# Altium project M_G_T.PrjPcb
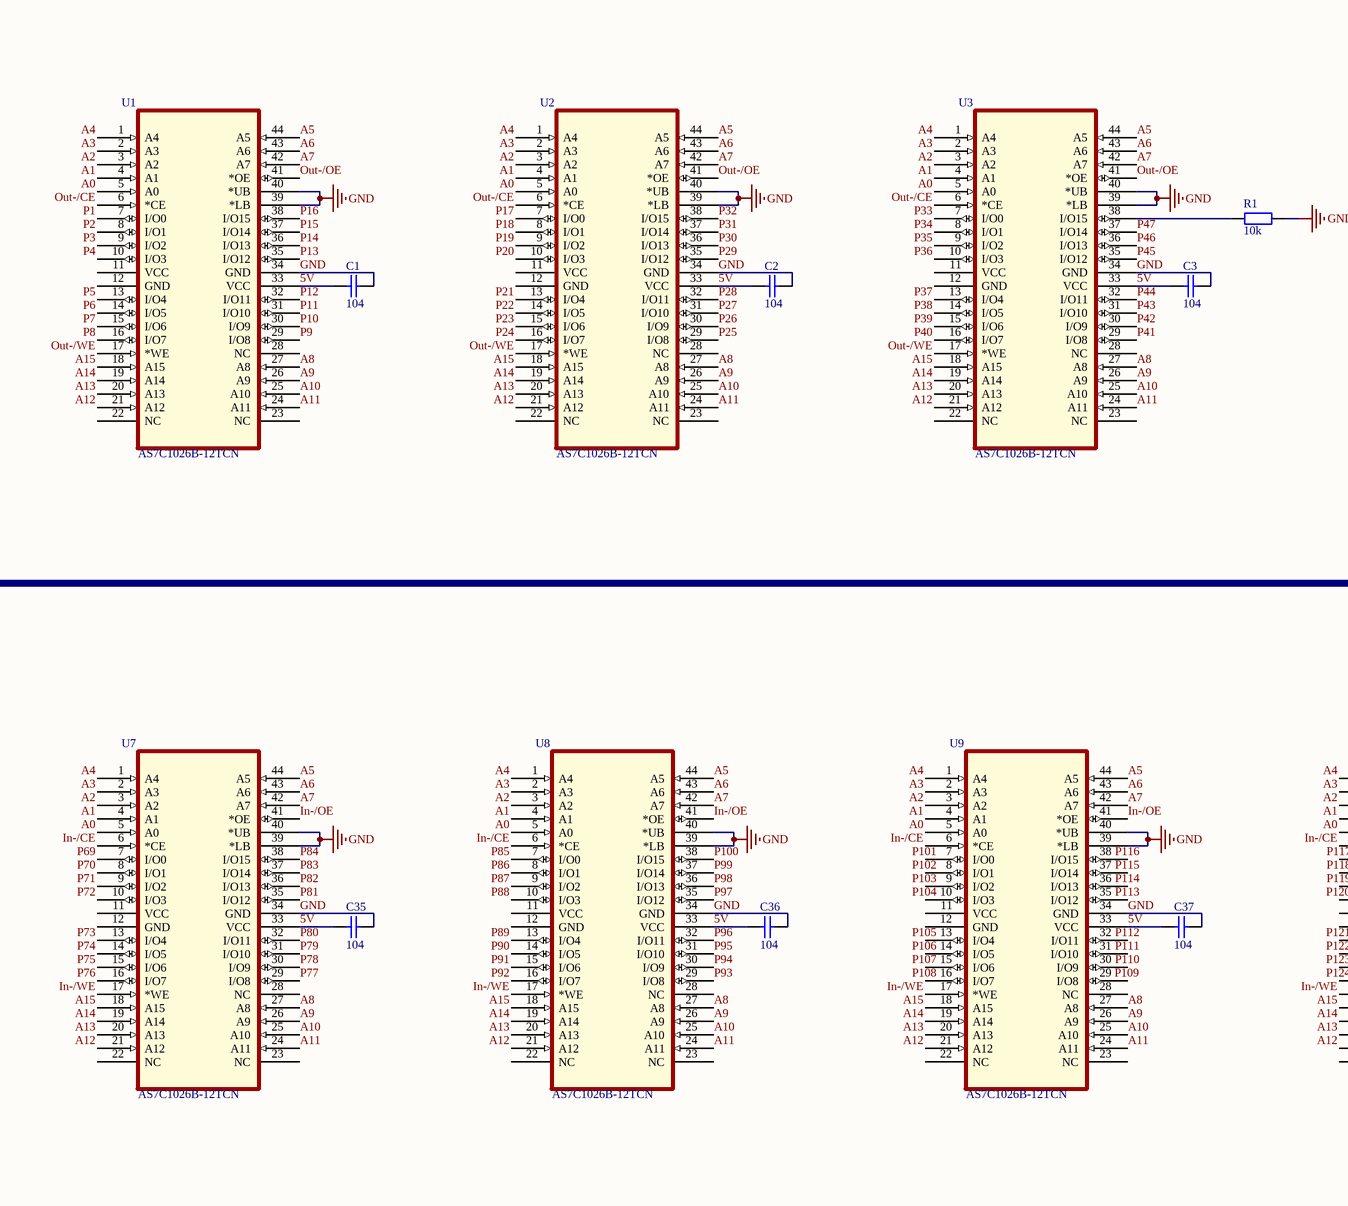
[diagram p0: M_G_T.SchDoc, top left]
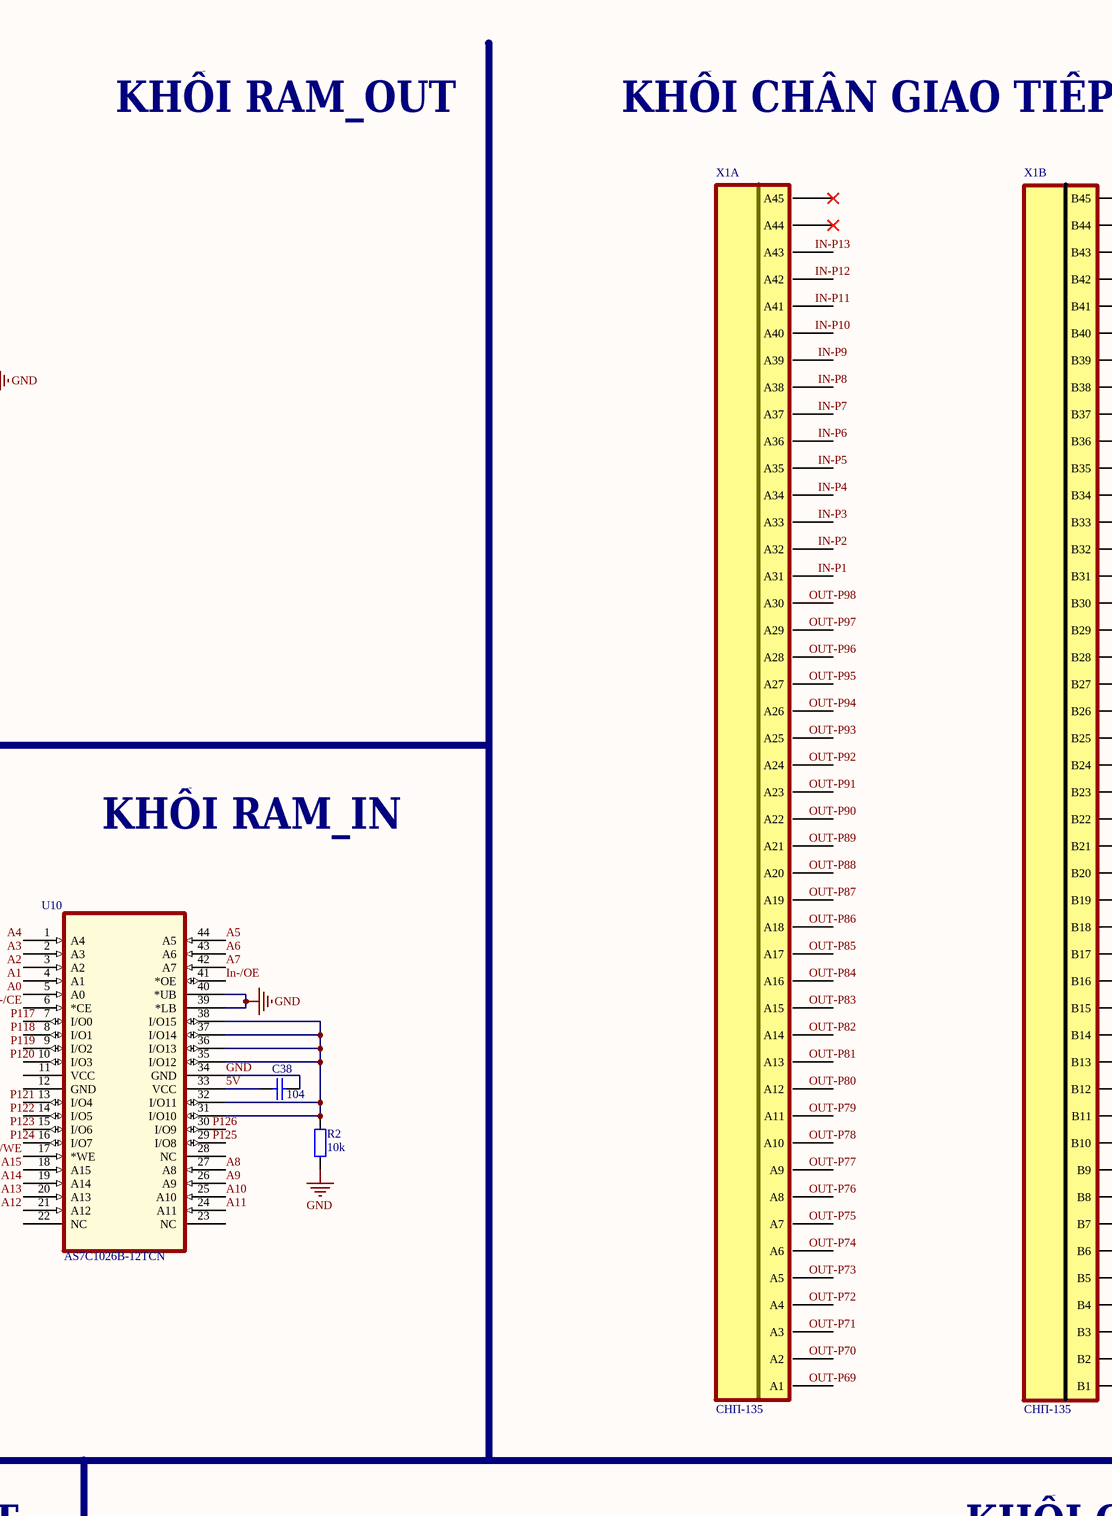
[diagram p1: M_G_T.SchDoc, top middle]
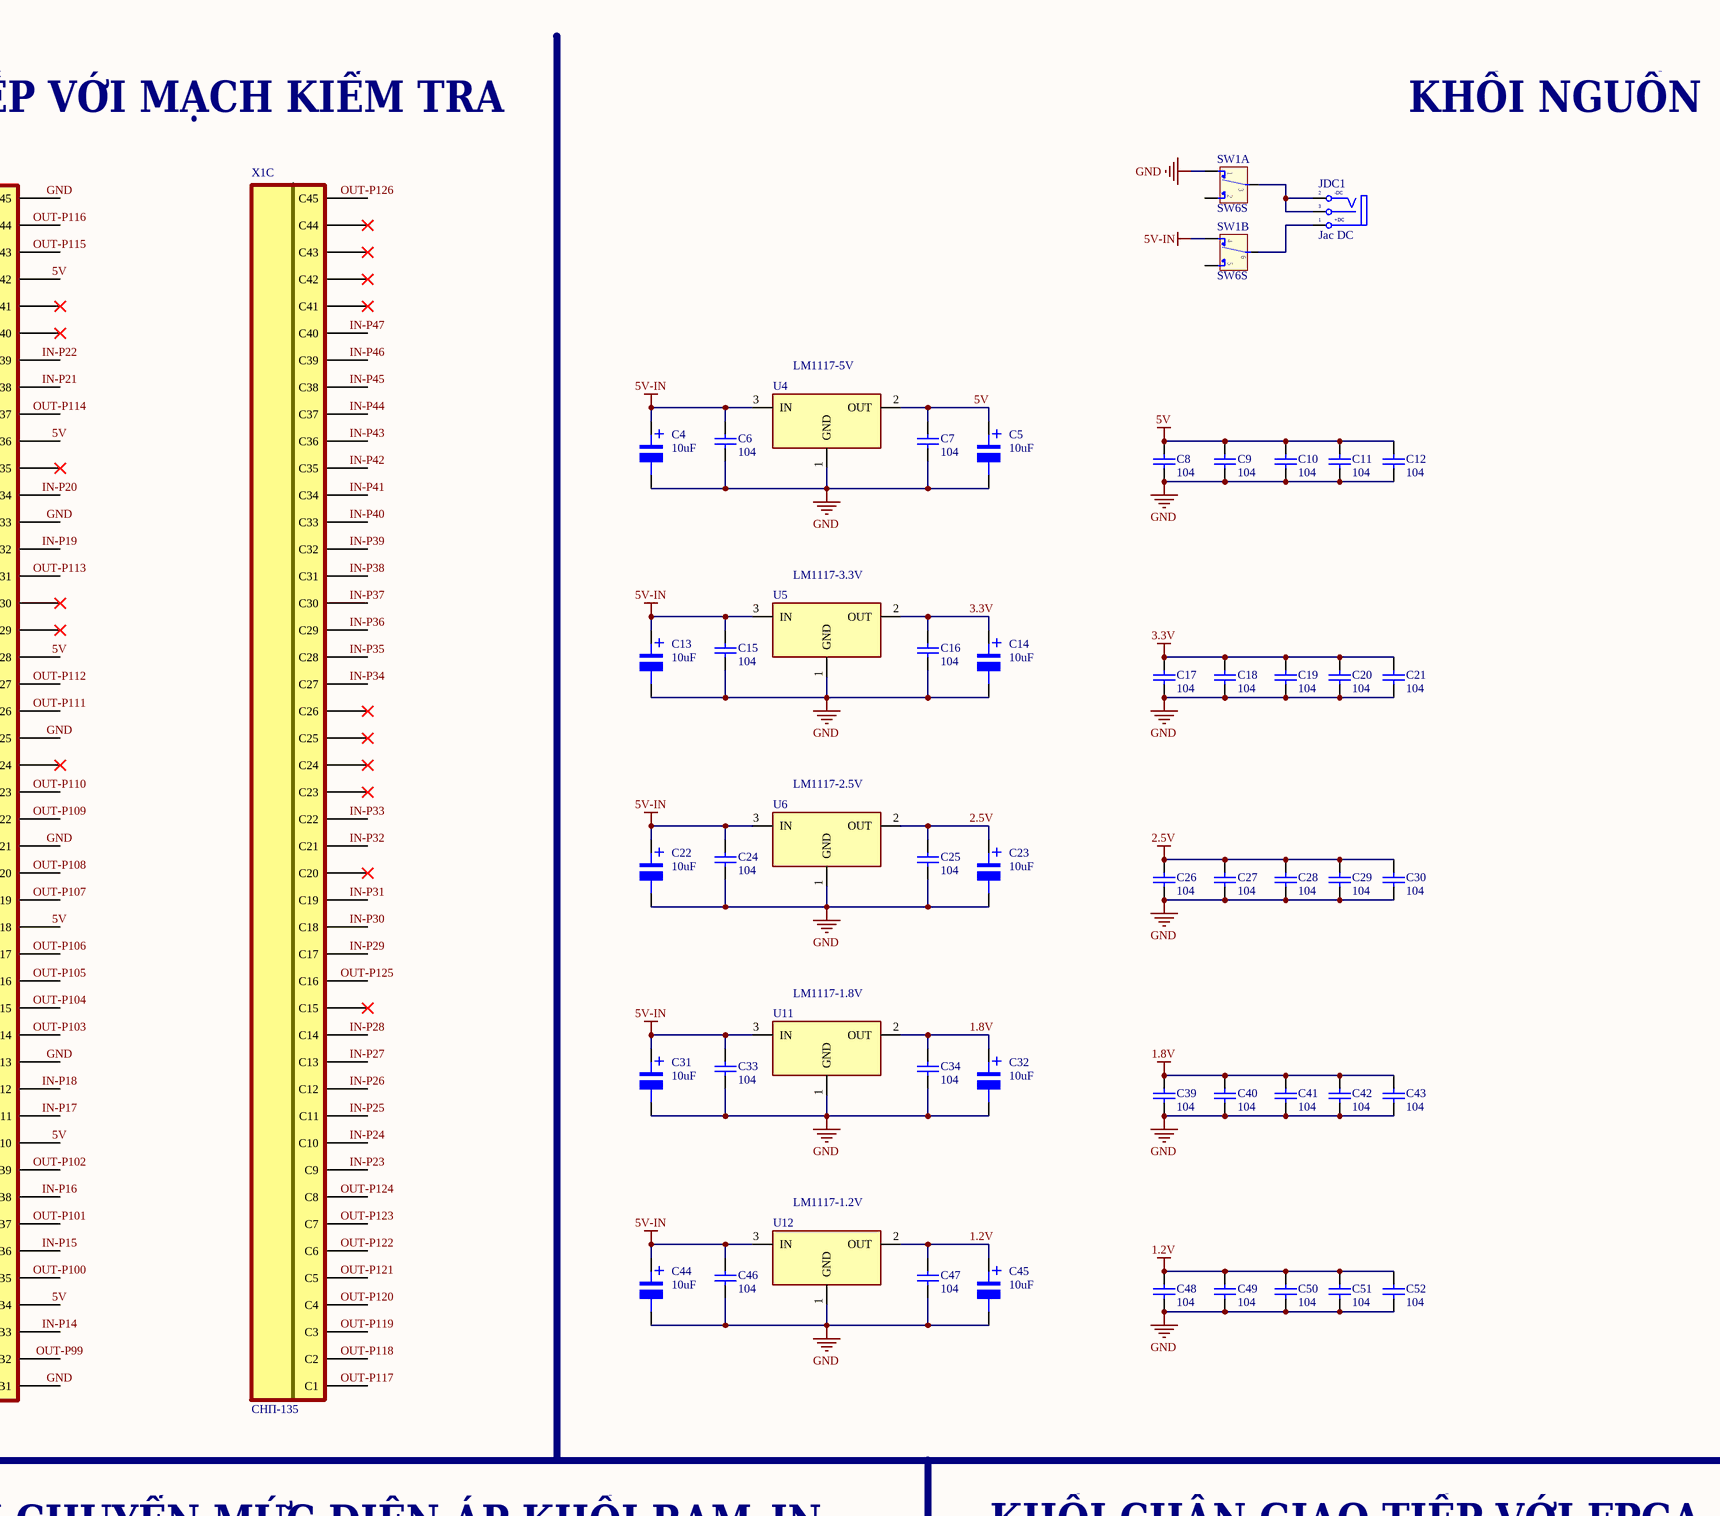
[diagram p2: M_G_T.SchDoc, top right]
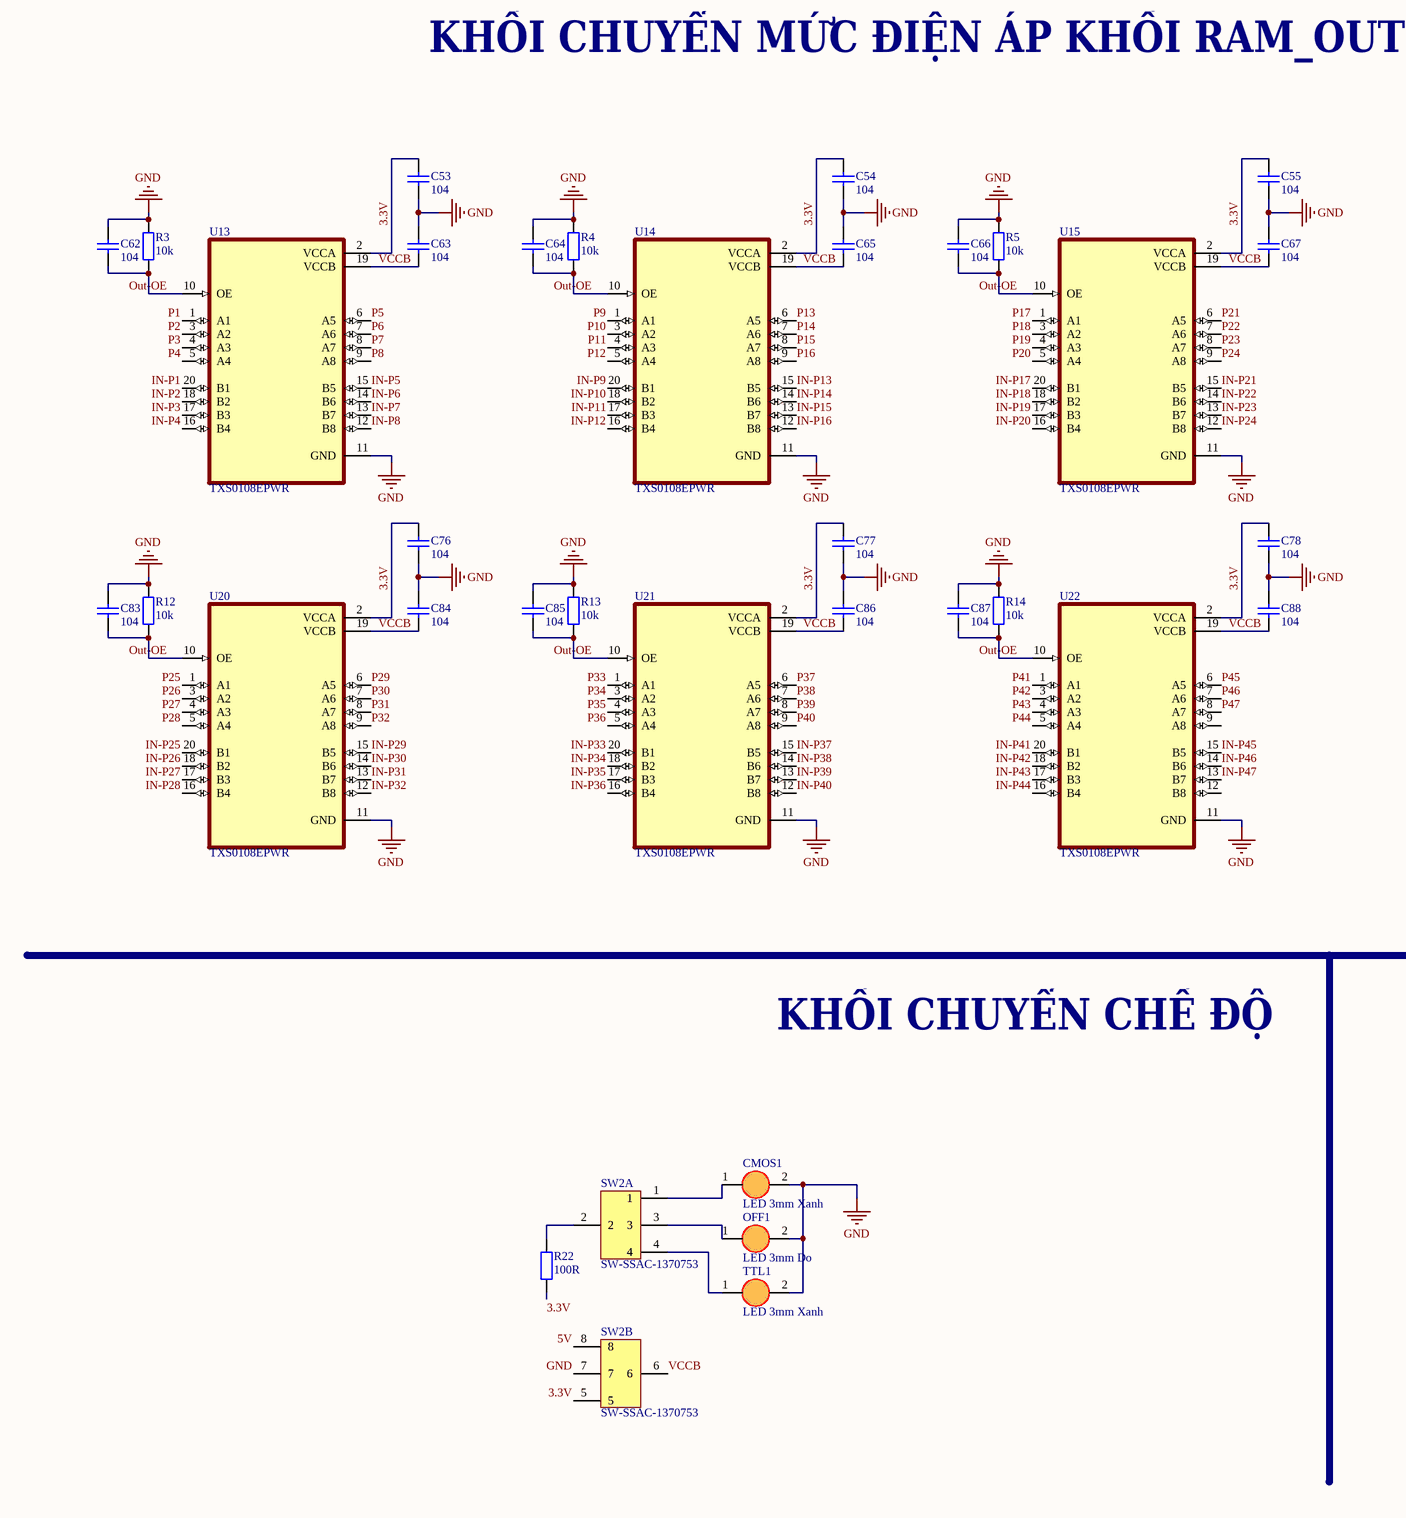
[diagram p3: M_G_T.SchDoc, bottom left]
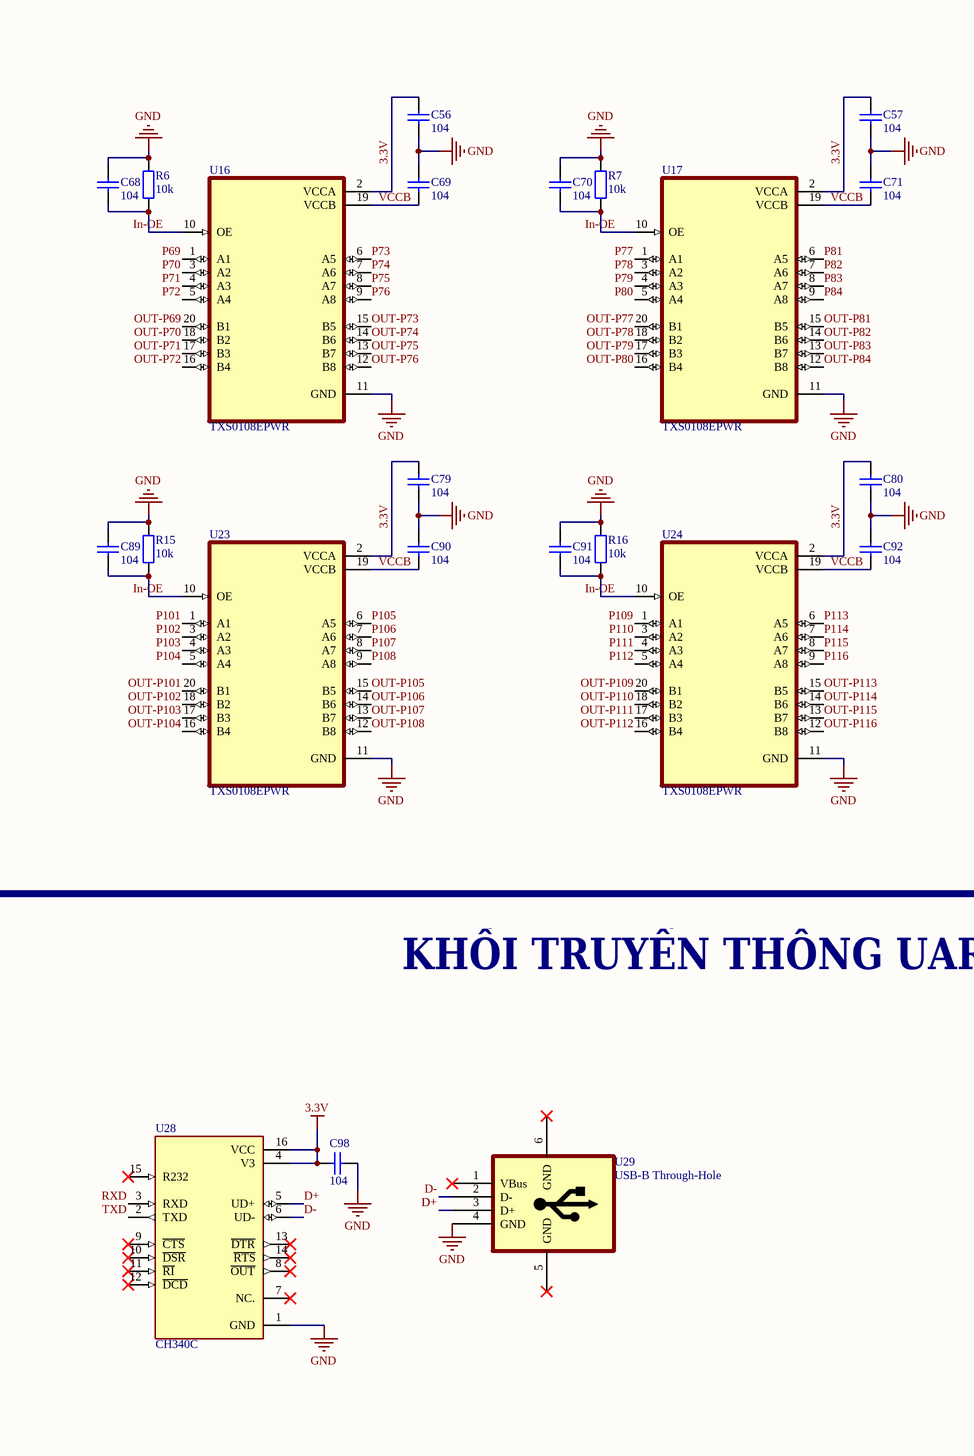
[diagram p4: M_G_T.SchDoc, bottom middle]
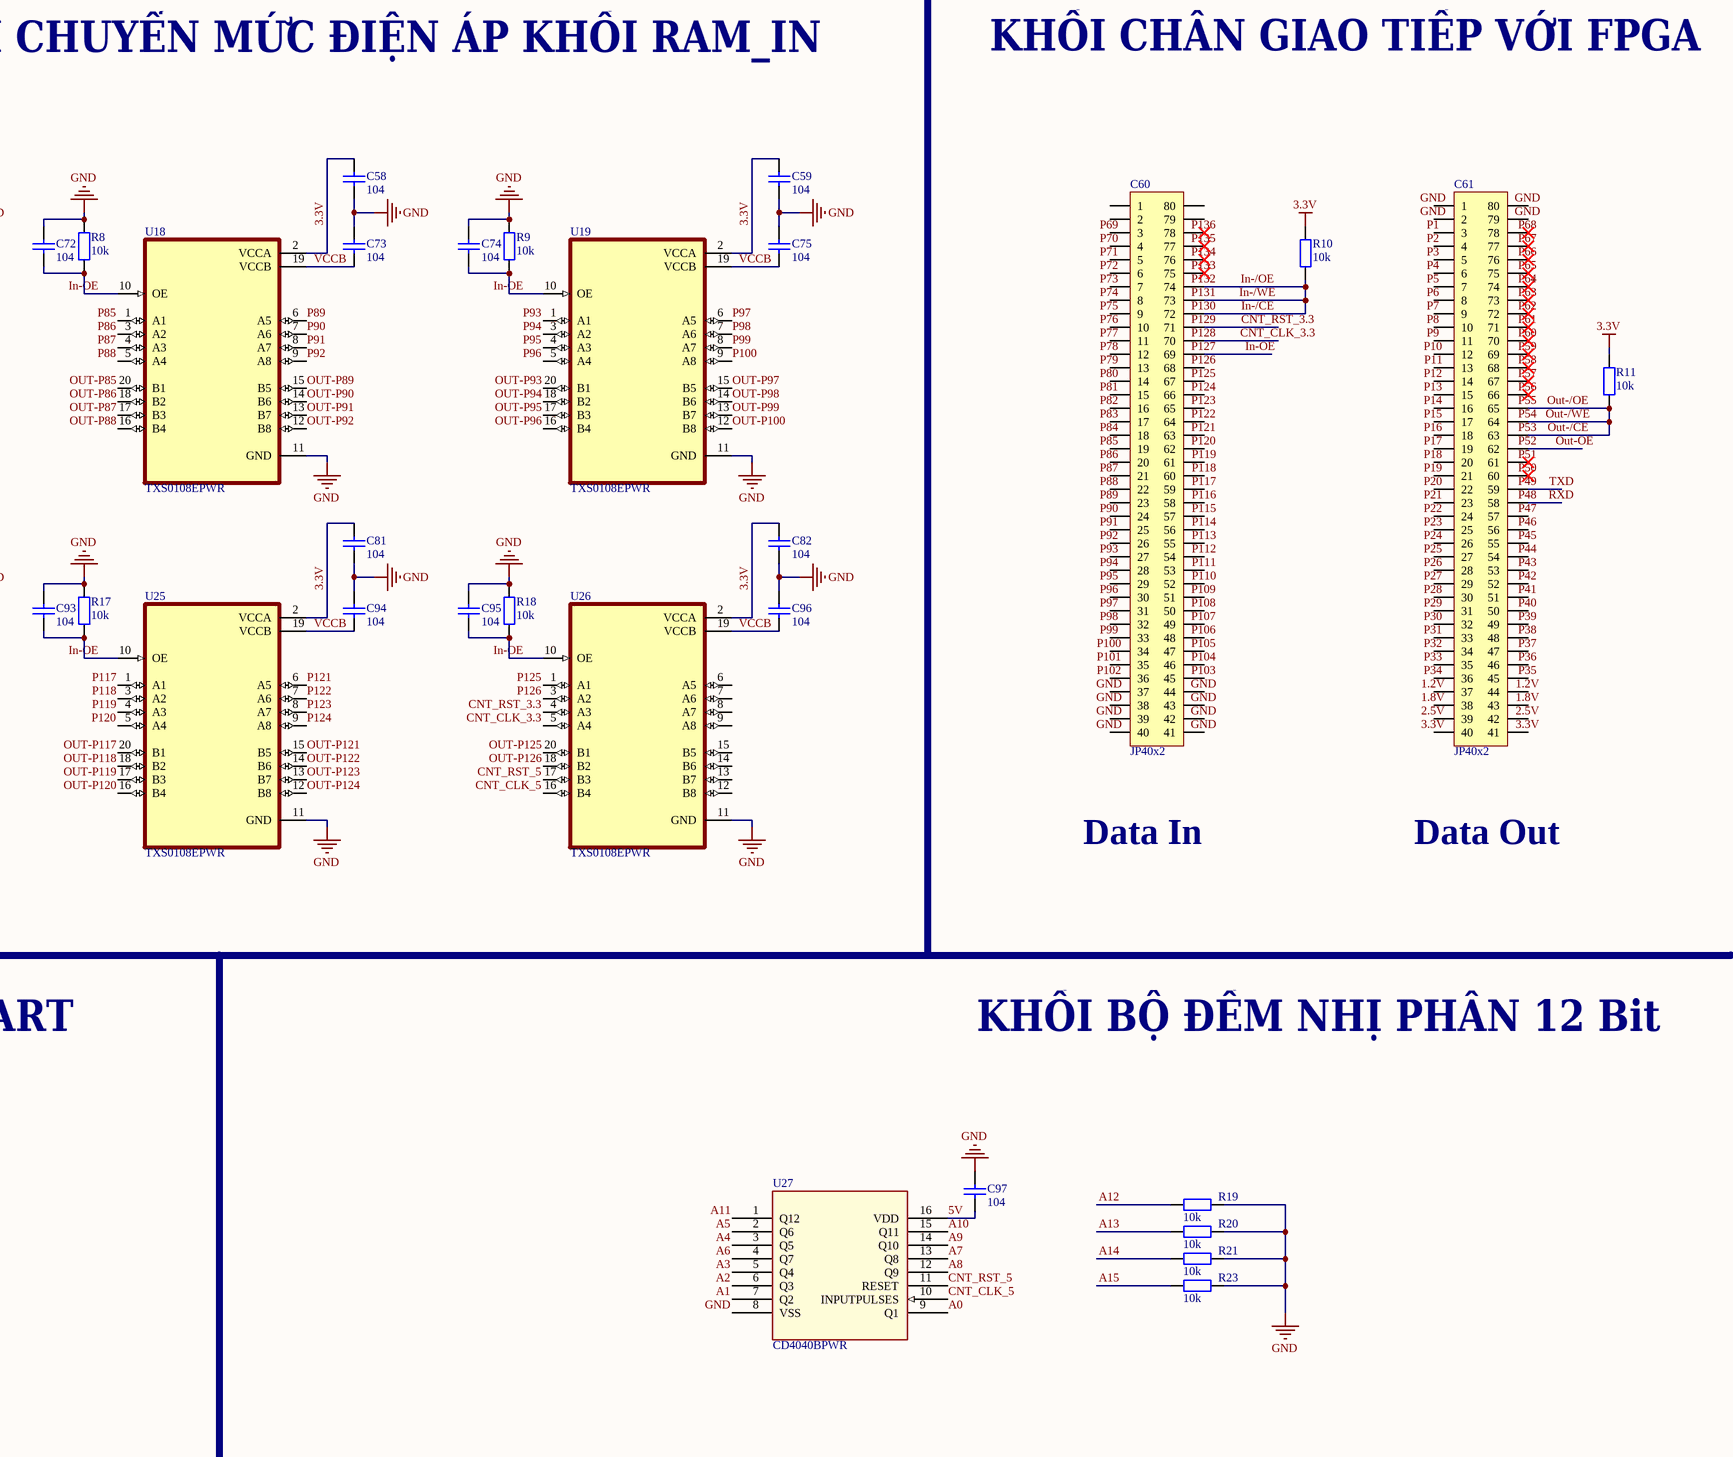
[diagram p5: M_G_T.SchDoc, bottom right]
1 sheet, 157 parts. Net scope: global (net labels, ports and power ports of the same name join across sheets).
Board file: M_G_T.PcbDoc

## Sheet M_G_T.SchDoc
size A1

### Parts
C1  104  [Tu 0805]
C2  104  [Tu 0805]
C3  104  [Tu 0805]
C4  10uF  [tu nhom 4 (b)]
C5  10uF  [tu nhom 4 (b)]
C6  104  [Tu 0805]
C7  104  [Tu 0805]
C8  104  [Tu 0805]
C9  104  [Tu 0805]
C10  104  [Tu 0805]
C11  104  [Tu 0805]
C12  104  [Tu 0805]
C13  10uF  [tu nhom 4 (b)]
C14  10uF  [tu nhom 4 (b)]
C15  104  [Tu 0805]
C16  104  [Tu 0805]
C17  104  [Tu 0805]
C18  104  [Tu 0805]
C19  104  [Tu 0805]
C20  104  [Tu 0805]
C21  104  [Tu 0805]
C22  10uF  [tu nhom 4 (b)]
C23  10uF  [tu nhom 4 (b)]
C24  104  [Tu 0805]
C25  104  [Tu 0805]
C26  104  [Tu 0805]
C27  104  [Tu 0805]
C28  104  [Tu 0805]
C29  104  [Tu 0805]
C30  104  [Tu 0805]
C31  10uF  [tu nhom 4 (b)]
C32  10uF  [tu nhom 4 (b)]
C33  104  [Tu 0805]
C34  104  [Tu 0805]
C35  104  [Tu 0805]
C36  104  [Tu 0805]
C37  104  [Tu 0805]
C38  104  [Tu 0805]
C39  104  [Tu 0805]
C40  104  [Tu 0805]
C41  104  [Tu 0805]
C42  104  [Tu 0805]
C43  104  [Tu 0805]
C44  10uF  [tu nhom 4 (b)]
C45  10uF  [tu nhom 4 (b)]
C46  104  [Tu 0805]
C47  104  [Tu 0805]
C48  104  [Tu 0805]
C49  104  [Tu 0805]
C50  104  [Tu 0805]
C51  104  [Tu 0805]
C52  104  [Tu 0805]
C53  104  [Tu 0805]
C54  104  [Tu 0805]
C55  104  [Tu 0805]
C56  104  [Tu 0805]
C57  104  [Tu 0805]
C58  104  [Tu 0805]
C59  104  [Tu 0805]
C60  JP40x2  [JP40-D2T]
C61  JP40x2  [JP40-D2T]
C62  104  [Tu 0805]
C63  104  [Tu 0805]
C64  104  [Tu 0805]
C65  104  [Tu 0805]
C66  104  [Tu 0805]
C67  104  [Tu 0805]
C68  104  [Tu 0805]
C69  104  [Tu 0805]
C70  104  [Tu 0805]
C71  104  [Tu 0805]
C72  104  [Tu 0805]
C73  104  [Tu 0805]
C74  104  [Tu 0805]
C75  104  [Tu 0805]
C76  104  [Tu 0805]
C77  104  [Tu 0805]
C78  104  [Tu 0805]
C79  104  [Tu 0805]
C80  104  [Tu 0805]
C81  104  [Tu 0805]
C82  104  [Tu 0805]
C83  104  [Tu 0805]
C84  104  [Tu 0805]
C85  104  [Tu 0805]
C86  104  [Tu 0805]
C87  104  [Tu 0805]
C88  104  [Tu 0805]
C89  104  [Tu 0805]
C90  104  [Tu 0805]
C91  104  [Tu 0805]
C92  104  [Tu 0805]
C93  104  [Tu 0805]
C94  104  [Tu 0805]
C95  104  [Tu 0805]
C96  104  [Tu 0805]
C97  104  [Tu 0805]
C98  104  [Tu 0805]
CMOS1  LED 3mm Xanh  [LED 3MM XANH]
JDC1  Jac DC  [DC-IN]
OFF1  LED 3mm Do  [LED 3mm Do]
R1  10k  [tro smd 0805]
R2  10k  [tro smd 0805]
R3  10k  [tro smd 0805]
R4  10k  [tro smd 0805]
R5  10k  [tro smd 0805]
R6  10k  [tro smd 0805]
R7  10k  [tro smd 0805]
R8  10k  [tro smd 0805]
R9  10k  [tro smd 0805]
R10  10k  [tro smd 0805]
R11  10k  [tro smd 0805]
R12  10k  [tro smd 0805]
R13  10k  [tro smd 0805]
R14  10k  [tro smd 0805]
R15  10k  [tro smd 0805]
R16  10k  [tro smd 0805]
R17  10k  [tro smd 0805]
R18  10k  [tro smd 0805]
R19  10k  [tro smd 0805]
R20  10k  [tro smd 0805]
R21  10k  [tro smd 0805]
R22  100R  [tro smd 0805]
R23  10k  [tro smd 0805]
SW1  SW6S  [SW6]  (parts A,B of 2)
SW2  SW-SSAC-1370753  [SW-SSAC-1370753]  (parts A,B of 2)
TTL1  LED 3mm Xanh  [LED 3MM XANH]
U1  AS7C1026B-12TCN  [TSOP-44_MIL400_ALL-M]
U2  AS7C1026B-12TCN  [TSOP-44_MIL400_ALL-M]
U3  AS7C1026B-12TCN  [TSOP-44_MIL400_ALL-M]
U4  LM1117-5V  [LM1117-SOP]
U5  LM1117-3.3V  [LM1117-SOP]
U6  LM1117-2.5V  [LM1117-SOP]
U7  AS7C1026B-12TCN  [TSOP-44_MIL400_ALL-M]
U8  AS7C1026B-12TCN  [TSOP-44_MIL400_ALL-M]
U9  AS7C1026B-12TCN  [TSOP-44_MIL400_ALL-M]
U10  AS7C1026B-12TCN  [TSOP-44_MIL400_ALL-M]
U11  LM1117-1.8V  [LM1117-SOP]
U12  LM1117-1.2V  [LM1117-SOP]
U13  TXS0108EPWR  [SOP65P640X120-20N]
U14  TXS0108EPWR  [SOP65P640X120-20N]
U15  TXS0108EPWR  [SOP65P640X120-20N]
U16  TXS0108EPWR  [SOP65P640X120-20N]
U17  TXS0108EPWR  [SOP65P640X120-20N]
U18  TXS0108EPWR  [SOP65P640X120-20N]
U19  TXS0108EPWR  [SOP65P640X120-20N]
U20  TXS0108EPWR  [SOP65P640X120-20N]
U21  TXS0108EPWR  [SOP65P640X120-20N]
U22  TXS0108EPWR  [SOP65P640X120-20N]
U23  TXS0108EPWR  [SOP65P640X120-20N]
U24  TXS0108EPWR  [SOP65P640X120-20N]
U25  TXS0108EPWR  [SOP65P640X120-20N]
U26  TXS0108EPWR  [SOP65P640X120-20N]
U27  CD4040BPWR  [PW16-M]
U28  CH340C  [SOIC127P600X180-16N]
U29  USB-B Through-Hole  [USB2.5-2H4D]
X1  СНП-135  [X2N]  (parts A,B,C of 3)

### Nets
1.2V: C45.1 C47.2 C48.2 C49.2 C50.2 C51.2 C52.2 C61.37 C61.44 U12.2(OUT)
1.8V: C32.1 C34.2 C39.2 C40.2 C41.2 C42.2 C43.2 C61.38 C61.43 U11.2(OUT)
2.5V: C23.1 C25.2 C26.2 C27.2 C28.2 C29.2 C30.2 C61.39 C61.42 U6.2(OUT)
3.3V: C14.1 C16.2 C17.2 C18.2 C19.2 C20.2 C21.2 C53.1 C54.1 C55.1 C56.1 C57.1 C58.1 C59.1 C61.40 C61.41 C76.1 C77.1 C78.1 C79.1 C80.1 C81.1 C82.1 C98.1 R10.1 R11.1 R22.1 SW2.5 U5.2(OUT) U13.2(VCCA) U14.2(VCCA) U15.2(VCCA) U16.2(VCCA) U17.2(VCCA) U18.2(VCCA) U19.2(VCCA) U20.2(VCCA) U21.2(VCCA) U22.2(VCCA) U23.2(VCCA) U24.2(VCCA) U25.2(VCCA) U26.2(VCCA) U28.4(V3) U28.16(VCC)
5V: C1.2 C2.2 C3.2 C5.1 C7.2 C8.2 C9.2 C10.2 C11.2 C12.2 C35.2 C36.2 C37.2 C38.2 C97.2 SW2.8 U1.33(VCC) U2.33(VCC) U3.33(VCC) U4.2(OUT) U7.33(VCC) U8.33(VCC) U9.33(VCC) U10.33(VCC) U27.16(VDD) X1.49(B4) X1.55(B10) X1.63(B18) X1.73(B28) X1.81(B36) X1.87(B42)
5V-IN: C4.1 C6.2 C13.1 C15.2 C22.1 C24.2 C31.1 C33.2 C44.1 C46.2 SW1.4 U4.3(IN) U5.3(IN) U6.3(IN) U11.3(IN) U12.3(IN)
GND: C1.1 C2.1 C3.1 C4.2 C5.2 C6.1 C7.1 C8.1 C9.1 C10.1 C11.1 C12.1 C13.2 C14.2 C15.1 C16.1 C17.1 C18.1 C19.1 C20.1 C21.1 C22.2 C23.2 C24.1 C25.1 C26.1 C27.1 C28.1 C29.1 C30.1 C31.2 C32.2 C33.1 C34.1 C35.1 C36.1 C37.1 C38.1 C39.1 C40.1 C41.1 C42.1 C43.1 C44.2 C45.2 C46.1 C47.1 C48.1 C49.1 C50.1 C51.1 C52.1 C53.2 C54.2 C55.2 C56.2 C57.2 C58.2 C59.2 C60.37 C60.38 C60.39 C60.40 C60.41 C60.42 C60.43 C60.44 C61.1 C61.2 C61.79 C61.80 C62.1 C63.1 C64.1 C65.1 C66.1 C67.1 C68.1 C69.1 C70.1 C71.1 C72.1 C73.1 C74.1 C75.1 C76.2 C77.2 C78.2 C79.2 C80.2 C81.2 C82.2 C83.1 C84.1 C85.1 C86.1 C87.1 C88.1 C89.1 C90.1 C91.1 C92.1 C93.1 C94.1 C95.1 C96.1 C97.1 C98.2 CMOS1.2(K) OFF1.2(K) R1.2 R2.2 R3.2 R4.2 R5.2 R6.2 R7.2 R8.2 R9.2 R12.2 R13.2 R14.2 R15.2 R16.2 R17.2 R18.2 R19.1 R20.1 R21.1 R23.1 SW1.1 SW2.7 TTL1.2(K) U1.34(GND) U1.39(*LB) U1.40(*UB) U2.34(GND) U2.39(*LB) U2.40(*UB) U3.34(GND) U3.39(*LB) U3.40(*UB) U4.1(GND) U5.1(GND) U6.1(GND) U7.34(GND) U7.39(*LB) U7.40(*UB) U8.34(GND) U8.39(*LB) U8.40(*UB) U9.34(GND) U9.39(*LB) U9.40(*UB) U10.34(GND) U10.39(*LB) U10.40(*UB) U11.1(GND) U12.1(GND) U13.11(GND) U14.11(GND) U15.11(GND) U16.11(GND) U17.11(GND) U18.11(GND) U19.11(GND) U20.11(GND) U21.11(GND) U22.11(GND) U23.11(GND) U24.11(GND) U25.11(GND) U26.11(GND) U27.8(VSS) U28.1(GND) U29.4(GND) X1.46(B1) X1.58(B13) X1.66(B21) X1.70(B25) X1.78(B33) X1.90(B45)
A0: U1.5(A0) U2.5(A0) U3.5(A0) U7.5(A0) U8.5(A0) U9.5(A0) U10.5(A0) U27.9(Q1)
A1: U1.4(A1) U2.4(A1) U3.4(A1) U7.4(A1) U8.4(A1) U9.4(A1) U10.4(A1) U27.7(Q2)
A2: U1.3(A2) U2.3(A2) U3.3(A2) U7.3(A2) U8.3(A2) U9.3(A2) U10.3(A2) U27.6(Q3)
A3: U1.2(A3) U2.2(A3) U3.2(A3) U7.2(A3) U8.2(A3) U9.2(A3) U10.2(A3) U27.5(Q4)
A4: U1.1(A4) U2.1(A4) U3.1(A4) U7.1(A4) U8.1(A4) U9.1(A4) U10.1(A4) U27.3(Q5)
A5: U1.44(A5) U2.44(A5) U3.44(A5) U7.44(A5) U8.44(A5) U9.44(A5) U10.44(A5) U27.2(Q6)
A6: U1.43(A6) U2.43(A6) U3.43(A6) U7.43(A6) U8.43(A6) U9.43(A6) U10.43(A6) U27.4(Q7)
A7: U1.42(A7) U2.42(A7) U3.42(A7) U7.42(A7) U8.42(A7) U9.42(A7) U10.42(A7) U27.13(Q8)
A8: U1.27(A8) U2.27(A8) U3.27(A8) U7.27(A8) U8.27(A8) U9.27(A8) U10.27(A8) U27.12(Q9)
A9: U1.26(A9) U2.26(A9) U3.26(A9) U7.26(A9) U8.26(A9) U9.26(A9) U10.26(A9) U27.14(Q10)
A10: U1.25(A10) U2.25(A10) U3.25(A10) U7.25(A10) U8.25(A10) U9.25(A10) U10.25(A10) U27.15(Q11)
A11: U1.24(A11) U2.24(A11) U3.24(A11) U7.24(A11) U8.24(A11) U9.24(A11) U10.24(A11) U27.1(Q12)
A12: R19.2 U1.21(A12) U2.21(A12) U3.21(A12) U7.21(A12) U8.21(A12) U9.21(A12) U10.21(A12)
A13: R20.2 U1.20(A13) U2.20(A13) U3.20(A13) U7.20(A13) U8.20(A13) U9.20(A13) U10.20(A13)
A14: R21.2 U1.19(A14) U2.19(A14) U3.19(A14) U7.19(A14) U8.19(A14) U9.19(A14) U10.19(A14)
A15: R23.2 U1.18(A15) U2.18(A15) U3.18(A15) U7.18(A15) U8.18(A15) U9.18(A15) U10.18(A15)
CNT_CLK_3.3: C60.70 U26.5(A4)  [also labelled P128]
CNT_CLK_5: U26.16(B4) U27.10(INPUTPULSES)
CNT_RST_3.3: C60.71 U26.4(A3)  [also labelled P129]
CNT_RST_5: U26.17(B3) U27.11(RESET)
D+: U28.5(UD+) U29.3(D+)
D-: U28.6(UD-) U29.2(D-)
In-/CE: C60.72 C60.73 C60.74 R10.2 U7.6(*CE) U7.17(*WE) U7.41(*OE) U8.6(*CE) U8.17(*WE) U8.41(*OE) U9.6(*CE) U9.17(*WE) U9.41(*OE) U10.6(*CE) U10.17(*WE) U10.41(*OE)  [also labelled In-/OE, In-/WE, P130, P131, P132]
In-OE: C60.69 C68.2 C70.2 C72.2 C74.2 C89.2 C91.2 C93.2 C95.2 R6.1 R7.1 R8.1 R9.1 R15.1 R16.1 R17.1 R18.1 U16.10(OE) U17.10(OE) U18.10(OE) U19.10(OE) U23.10(OE) U24.10(OE) U25.10(OE) U26.10(OE)  [also labelled P127]
IN-P1: U13.20(B1) X1.31(A31)
IN-P2: U13.18(B2) X1.32(A32)
IN-P3: U13.17(B3) X1.33(A33)
IN-P4: U13.16(B4) X1.34(A34)
IN-P5: U13.15(B5) X1.35(A35)
IN-P6: U13.14(B6) X1.36(A36)
IN-P7: U13.13(B7) X1.37(A37)
IN-P8: U13.12(B8) X1.38(A38)
IN-P9: U14.20(B1) X1.39(A39)
IN-P10: U14.18(B2) X1.40(A40)
IN-P11: U14.17(B3) X1.41(A41)
IN-P12: U14.16(B4) X1.42(A42)
IN-P13: U14.15(B5) X1.43(A43)
IN-P14: U14.14(B6) X1.48(B3)
IN-P15: U14.13(B7) X1.51(B6)
IN-P16: U14.12(B8) X1.53(B8)
IN-P17: U15.20(B1) X1.56(B11)
IN-P18: U15.18(B2) X1.57(B12)
IN-P19: U15.17(B3) X1.77(B32)
IN-P20: U15.16(B4) X1.79(B34)
IN-P21: U15.15(B5) X1.83(B38)
IN-P22: U15.14(B6) X1.84(B39)
IN-P23: U15.13(B7) X1.99(C9)
IN-P24: U15.12(B8) X1.100(C10)
IN-P25: U20.20(B1) X1.101(C11)
IN-P26: U20.18(B2) X1.102(C12)
IN-P27: U20.17(B3) X1.103(C13)
IN-P28: U20.16(B4) X1.104(C14)
IN-P29: U20.15(B5) X1.107(C17)
IN-P30: U20.14(B6) X1.108(C18)
IN-P31: U20.13(B7) X1.109(C19)
IN-P32: U20.12(B8) X1.111(C21)
IN-P33: U21.20(B1) X1.112(C22)
IN-P34: U21.18(B2) X1.117(C27)
IN-P35: U21.17(B3) X1.118(C28)
IN-P36: U21.16(B4) X1.119(C29)
IN-P37: U21.15(B5) X1.120(C30)
IN-P38: U21.14(B6) X1.121(C31)
IN-P39: U21.13(B7) X1.122(C32)
IN-P40: U21.12(B8) X1.123(C33)
IN-P41: U22.20(B1) X1.124(C34)
IN-P42: U22.18(B2) X1.125(C35)
IN-P43: U22.17(B3) X1.126(C36)
IN-P44: U22.16(B4) X1.127(C37)
IN-P45: U22.15(B5) X1.128(C38)
IN-P46: U22.14(B6) X1.129(C39)
IN-P47: U22.13(B7) X1.130(C40)
Out-/CE: C61.63 C61.64 C61.65 R11.2 U1.6(*CE) U1.17(*WE) U1.41(*OE) U2.6(*CE) U2.17(*WE) U2.41(*OE) U3.6(*CE) U3.17(*WE) U3.41(*OE)  [also labelled Out-/OE, Out-/WE, P53, P54, P55]
Out-OE: C61.62 C62.2 C64.2 C66.2 C83.2 C85.2 C87.2 R3.1 R4.1 R5.1 R12.1 R13.1 R14.1 U13.10(OE) U14.10(OE) U15.10(OE) U20.10(OE) U21.10(OE) U22.10(OE)  [also labelled P52]
OUT-P69: U16.20(B1) X1.1(A1)
OUT-P70: U16.18(B2) X1.2(A2)
OUT-P71: U16.17(B3) X1.3(A3)
OUT-P72: U16.16(B4) X1.4(A4)
OUT-P73: U16.15(B5) X1.5(A5)
OUT-P74: U16.14(B6) X1.6(A6)
OUT-P75: U16.13(B7) X1.7(A7)
OUT-P76: U16.12(B8) X1.8(A8)
OUT-P77: U17.20(B1) X1.9(A9)
OUT-P78: U17.18(B2) X1.10(A10)
OUT-P79: U17.17(B3) X1.11(A11)
OUT-P80: U17.16(B4) X1.12(A12)
OUT-P81: U17.15(B5) X1.13(A13)
OUT-P82: U17.14(B6) X1.14(A14)
OUT-P83: U17.13(B7) X1.15(A15)
OUT-P84: U17.12(B8) X1.16(A16)
OUT-P85: U18.20(B1) X1.17(A17)
OUT-P86: U18.18(B2) X1.18(A18)
OUT-P87: U18.17(B3) X1.19(A19)
OUT-P88: U18.16(B4) X1.20(A20)
OUT-P89: U18.15(B5) X1.21(A21)
OUT-P90: U18.14(B6) X1.22(A22)
OUT-P91: U18.13(B7) X1.23(A23)
OUT-P92: U18.12(B8) X1.24(A24)
OUT-P93: U19.20(B1) X1.25(A25)
OUT-P94: U19.18(B2) X1.26(A26)
OUT-P95: U19.17(B3) X1.27(A27)
OUT-P96: U19.16(B4) X1.28(A28)
OUT-P97: U19.15(B5) X1.29(A29)
OUT-P98: U19.14(B6) X1.30(A30)
OUT-P99: U19.13(B7) X1.47(B2)
OUT-P100: U19.12(B8) X1.50(B5)
OUT-P101: U23.20(B1) X1.52(B7)
OUT-P102: U23.18(B2) X1.54(B9)
OUT-P103: U23.17(B3) X1.59(B14)
OUT-P104: U23.16(B4) X1.60(B15)
OUT-P105: U23.15(B5) X1.61(B16)
OUT-P106: U23.14(B6) X1.62(B17)
OUT-P107: U23.13(B7) X1.64(B19)
OUT-P108: U23.12(B8) X1.65(B20)
OUT-P109: U24.20(B1) X1.67(B22)
OUT-P110: U24.18(B2) X1.68(B23)
OUT-P111: U24.17(B3) X1.71(B26)
OUT-P112: U24.16(B4) X1.72(B27)
OUT-P113: U24.15(B5) X1.76(B31)
OUT-P114: U24.14(B6) X1.82(B37)
OUT-P115: U24.13(B7) X1.88(B43)
OUT-P116: U24.12(B8) X1.89(B44)
OUT-P117: U25.20(B1) X1.91(C1)
OUT-P118: U25.18(B2) X1.92(C2)
OUT-P119: U25.17(B3) X1.93(C3)
OUT-P120: U25.16(B4) X1.94(C4)
OUT-P121: U25.15(B5) X1.95(C5)
OUT-P122: U25.14(B6) X1.96(C6)
OUT-P123: U25.13(B7) X1.97(C7)
OUT-P124: U25.12(B8) X1.98(C8)
OUT-P125: U26.20(B1) X1.106(C16)
OUT-P126: U26.18(B2) X1.135(C45)
P1: C61.3 U1.7(I/O0) U13.1(A1)
P2: C61.4 U1.8(I/O1) U13.3(A2)
P3: C61.5 U1.9(I/O2) U13.4(A3)
P4: C61.6 U1.10(I/O3) U13.5(A4)
P5: C61.7 U1.13(I/O4) U13.6(A5)
P6: C61.8 U1.14(I/O5) U13.7(A6)
P7: C61.9 U1.15(I/O6) U13.8(A7)
P8: C61.10 U1.16(I/O7) U13.9(A8)
P9: C61.11 U1.29(I/O8) U14.1(A1)
P10: C61.12 U1.30(I/O9) U14.3(A2)
P11: C61.13 U1.31(I/O10) U14.4(A3)
P12: C61.14 U1.32(I/O11) U14.5(A4)
P13: C61.15 U1.35(I/O12) U14.6(A5)
P14: C61.16 U1.36(I/O13) U14.7(A6)
P15: C61.17 U1.37(I/O14) U14.8(A7)
P16: C61.18 U1.38(I/O15) U14.9(A8)
P17: C61.19 U2.7(I/O0) U15.1(A1)
P18: C61.20 U2.8(I/O1) U15.3(A2)
P19: C61.21 U2.9(I/O2) U15.4(A3)
P20: C61.22 U2.10(I/O3) U15.5(A4)
P21: C61.23 U2.13(I/O4) U15.6(A5)
P22: C61.24 U2.14(I/O5) U15.7(A6)
P23: C61.25 U2.15(I/O6) U15.8(A7)
P24: C61.26 U2.16(I/O7) U15.9(A8)
P25: C61.27 U2.29(I/O8) U20.1(A1)
P26: C61.28 U2.30(I/O9) U20.3(A2)
P27: C61.29 U2.31(I/O10) U20.4(A3)
P28: C61.30 U2.32(I/O11) U20.5(A4)
P29: C61.31 U2.35(I/O12) U20.6(A5)
P30: C61.32 U2.36(I/O13) U20.7(A6)
P31: C61.33 U2.37(I/O14) U20.8(A7)
P32: C61.34 U2.38(I/O15) U20.9(A8)
P33: C61.35 U3.7(I/O0) U21.1(A1)
P34: C61.36 U3.8(I/O1) U21.3(A2)
P35: C61.45 U3.9(I/O2) U21.4(A3)
P36: C61.46 U3.10(I/O3) U21.5(A4)
P37: C61.47 U3.13(I/O4) U21.6(A5)
P38: C61.48 U3.14(I/O5) U21.7(A6)
P39: C61.49 U3.15(I/O6) U21.8(A7)
P40: C61.50 U3.16(I/O7) U21.9(A8)
P41: C61.51 U3.29(I/O8) U22.1(A1)
P42: C61.52 U3.30(I/O9) U22.3(A2)
P43: C61.53 U3.31(I/O10) U22.4(A3)
P44: C61.54 U3.32(I/O11) U22.5(A4)
P45: C61.55 U3.35(I/O12) U22.6(A5)
P46: C61.56 U3.36(I/O13) U22.7(A6)
P47: C61.57 U3.37(I/O14) U22.8(A7)
P48: C61.58 U28.3(RXD)  [also labelled RXD]
P49: C61.59 U28.2(TXD)  [also labelled TXD]
P50: C61.60
P51: C61.61
P56: C61.66
P57: C61.67
P58: C61.68
P59: C61.69
P60: C61.70
P61: C61.71
P62: C61.72
P63: C61.73
P64: C61.74
P65: C61.75
P66: C61.76
P67: C61.77
P68: C61.78
P69: C60.3 U7.7(I/O0) U16.1(A1)
P70: C60.4 U7.8(I/O1) U16.3(A2)
P71: C60.5 U7.9(I/O2) U16.4(A3)
P72: C60.6 U7.10(I/O3) U16.5(A4)
P73: C60.7 U7.13(I/O4) U16.6(A5)
P74: C60.8 U7.14(I/O5) U16.7(A6)
P75: C60.9 U7.15(I/O6) U16.8(A7)
P76: C60.10 U7.16(I/O7) U16.9(A8)
P77: C60.11 U7.29(I/O8) U17.1(A1)
P78: C60.12 U7.30(I/O9) U17.3(A2)
P79: C60.13 U7.31(I/O10) U17.4(A3)
P80: C60.14 U7.32(I/O11) U17.5(A4)
P81: C60.15 U7.35(I/O12) U17.6(A5)
P82: C60.16 U7.36(I/O13) U17.7(A6)
P83: C60.17 U7.37(I/O14) U17.8(A7)
P84: C60.18 U7.38(I/O15) U17.9(A8)
P85: C60.19 U8.7(I/O0) U18.1(A1)
P86: C60.20 U8.8(I/O1) U18.3(A2)
P87: C60.21 U8.9(I/O2) U18.4(A3)
P88: C60.22 U8.10(I/O3) U18.5(A4)
P89: C60.23 U8.13(I/O4) U18.6(A5)
P90: C60.24 U8.14(I/O5) U18.7(A6)
P91: C60.25 U8.15(I/O6) U18.8(A7)
P92: C60.26 U8.16(I/O7) U18.9(A8)
P93: C60.27 U8.29(I/O8) U19.1(A1)
P94: C60.28 U8.30(I/O9) U19.3(A2)
P95: C60.29 U8.31(I/O10) U19.4(A3)
P96: C60.30 U8.32(I/O11) U19.5(A4)
P97: C60.31 U8.35(I/O12) U19.6(A5)
P98: C60.32 U8.36(I/O13) U19.7(A6)
P99: C60.33 U8.37(I/O14) U19.8(A7)
P100: C60.34 U8.38(I/O15) U19.9(A8)
P101: C60.35 U9.7(I/O0) U23.1(A1)
P102: C60.36 U9.8(I/O1) U23.3(A2)
P103: C60.45 U9.9(I/O2) U23.4(A3)
P104: C60.46 U9.10(I/O3) U23.5(A4)
P105: C60.47 U9.13(I/O4) U23.6(A5)
P106: C60.48 U9.14(I/O5) U23.7(A6)
P107: C60.49 U9.15(I/O6) U23.8(A7)
P108: C60.50 U9.16(I/O7) U23.9(A8)
P109: C60.51 U9.29(I/O8) U24.1(A1)
P110: C60.52 U9.30(I/O9) U24.3(A2)
P111: C60.53 U9.31(I/O10) U24.4(A3)
P112: C60.54 U9.32(I/O11) U24.5(A4)
P113: C60.55 U9.35(I/O12) U24.6(A5)
P114: C60.56 U9.36(I/O13) U24.7(A6)
P115: C60.57 U9.37(I/O14) U24.8(A7)
P116: C60.58 U9.38(I/O15) U24.9(A8)
P117: C60.59 U10.7(I/O0) U25.1(A1)
P118: C60.60 U10.8(I/O1) U25.3(A2)
P119: C60.61 U10.9(I/O2) U25.4(A3)
P120: C60.62 U10.10(I/O3) U25.5(A4)
P121: C60.63 U10.13(I/O4) U25.6(A5)
P122: C60.64 U10.14(I/O5) U25.7(A6)
P123: C60.65 U10.15(I/O6) U25.8(A7)
P124: C60.66 U10.16(I/O7) U25.9(A8)
P125: C60.67 U10.29(I/O8) U26.1(A1)
P126: C60.68 U10.30(I/O9) U26.3(A2)
P133: C60.75
P134: C60.76
P135: C60.77
P136: C60.78
VCCB: C63.2 C65.2 C67.2 C69.2 C71.2 C73.2 C75.2 C84.2 C86.2 C88.2 C90.2 C92.2 C94.2 C96.2 SW2.6 U13.19(VCCB) U14.19(VCCB) U15.19(VCCB) U16.19(VCCB) U17.19(VCCB) U18.19(VCCB) U19.19(VCCB) U20.19(VCCB) U21.19(VCCB) U22.19(VCCB) U23.19(VCCB) U24.19(VCCB) U25.19(VCCB) U26.19(VCCB)
NetCMOS1_1: CMOS1.1(A) SW2.1
NetJDC1_1: JDC1.1(T) SW1.6
NetJDC1_2: JDC1.2(TN) JDC1.3(S) SW1.3
NetOFF1_1: OFF1.1(A) SW2.3
NetR1_1: R1.1 U3.38(I/O15)
NetR2_1: R2.1 U10.31(I/O10) U10.32(I/O11) U10.35(I/O12) U10.36(I/O13) U10.37(I/O14) U10.38(I/O15)
NetR22_2: R22.2 SW2.2
NetSW2_4: SW2.4 TTL1.1(A)

Not connected (* = marked no-connect by the designer): C60 1 2 79 80; SW1 2 5; U1 11(VCC) 12(GND) 22(NC) 23(NC) 28(NC); U2 11(VCC) 12(GND) 22(NC) 23(NC) 28(NC); U3 11(VCC) 12(GND) 22(NC) 23(NC) 28(NC); U7 11(VCC) 12(GND) 22(NC) 23(NC) 28(NC); U8 11(VCC) 12(GND) 22(NC) 23(NC) 28(NC); U9 11(VCC) 12(GND) 22(NC) 23(NC) 28(NC); U10 11(VCC) 12(GND) 22(NC) 23(NC) 28(NC); U22 9(A8) 12(B8); U26 6(A5) 7(A6) 8(A7) 9(A8) 12(B8) 13(B7) 14(B6) 15(B5); U28 7(NC.)* 8(~{OUT})* 9(~{CTS})* 10(~{DSR})* 11(~{RI})* 12(~{DCD})* 13(~{DTR})* 14(~{RTS})* 15(R232)*; U29 1(VBus)* 5(GND)* 6(GND)*; X1 44(A44)* 45(A45)* 69(B24)* 74(B29)* 75(B30)* 80(B35)* 85(B40)* 86(B41)* 105(C15)* 110(C20)* 113(C23)* 114(C24)* 115(C25)* 116(C26)* 131(C41)* 132(C42)* 133(C43)* 134(C44)*

### Notes on the sheet
- KHỐI RAM_OUT
- KHỐI CHÂN GIAO TIẾP VỚI MẠCH KIỂM TRA
- KHỐI NGUỒN
- KHỐI RAM_IN
- KHỐI CHUYỂN MỨC ĐIỆN ÁP KHỐI RAM_OUT
- KHỐI CHUYỂN MỨC ĐIỆN ÁP KHỐI RAM_IN
- KHỐI CHÂN GIAO TIẾP VỚI FPGA
- Data In
- Data Out
- KHỐI TRUYỀN THÔNG UART
- KHỐI BỘ ĐẾM NHỊ PHÂN 12 Bit
- KHỐI CHUYỂN CHẾ ĐỘ
- (in symbol DCIN) -DC; +DC
- (in symbol Tu Nhom 10uF 16V) +

### Library data of the parts
C1-C3 C6-C12 C15-C21 C24-C30 C33-C43 C46-C59 C62-C98 = Tu 104: Dán; Ten_Linh_Kien: Tụ 0805 104-100nF 10% 50V; Don_Vi: Con; Ma_Hang: MH004551; Kieu_Chan: *; Chung_Loai: Dán; Ghi_Chu: *
C4 C5 C13 C14 C22 C23 C31 C32 C44 C45 = Tu Nhom 10uF 16V: Dán; Don_Vi: Con; So_Chan: 2; Ten_Linh_Kien: Tụ Nhôm 10uF 16V 4x5MM; Ma_Hang: MH001458; Chung_Loai: Dán; Kieu_Chan: *
C60 C61 = JP40x2: WR-PHD 2.54 mm Dual Socket Header; Manufacturer: W¨¹rth Elektronik eiSos GmbH; partNo: 61307221821; ComponentLink1 Description: Manufacturer; ComponentLink2 Description: Datasheet; NoPins: 72; Created Date: 29 March 2013; ComponentLink1URL: http://www.we-online.com; ComponentLink2URL: http://katalog.we-online.de/em/datasheet/6130xx21821.pdf; Created by: Karrer Zheng
CMOS1 TTL1 = LED 3mm Xanh: Cắm; Ten_Linh_Kien: LED 3MM Xanh Lá ( SS); Ma_Hang: MH004935; Don_Vi: Con; Ghi_Chu: *; Kieu_Chan: *; Chung_Loai: Cắm
JDC1 = DCIN: Jac DC input; Value: Jac DC
OFF1 = LED 3mm Do: Cắm; Ten_Linh_Kien: LED 3MM Sáng Đỏ ( SS); Ma_Hang: MH004931; Don_Vi: Con; Ghi_Chu: *; Kieu_Chan: *; Chung_Loai: Cắm
R1-R21 R23 = Tro 0805 5% 10k: Dán; Don_Vi: Con; So_Chan: 2; Ten_Linh_Kien: Trở 0805 5% 10k; Ma_Hang: MH005239; Chung_Loai: Dán; Kieu_Chan: *
R22 = Tro 0805 5% 100R: Dán; Don_Vi: Con; So_Chan: 2; Ten_Linh_Kien: Trở 0805 5% 100R; Ma_Hang: MH005251; Chung_Loai: Dán; Kieu_Chan: *
SW1 = SW6S: SW-DTDP - 6 Pin; Value: SW6
U1-U3 U7-U10 = AS7C1026B-12TCN: RAM 16data, 16address; Mfr_Name: Alliance Memory; Copyright: Copyright (C) 2023 Ultra Librarian. All rights reserved.; Manufacturer_Part_Number: AS7C1026B-12TCN; RefDes: RefDes; Type: DEV
U4-U6 U11 U12 = LM1117: 800mA Low-Dropout Linear Regulator; Creator: Nguyen Ba Bien; Website: http://group3i.net
U13-U26 = TXS0108EPWR: Chuyển đổi điệp áp 3.3V-5V; Price: None; Package: None; Availability: Unavailable; MP: TXS0108EPWR; Value: *
U27 = CD4040BPWR: Bộ đếm 12bit nhị phân; Mfr_Name: Texas Instruments; Copyright: Copyright (C) 2023 Ultra Librarian. All rights reserved.; Manufacturer_Part_Number: CD4040BPWR; RefDes: RefDes; Type: DEV
U28 = CH340C: USB to TTL (thạch anh nội); MF: {'manufacturer': u'WCH'}; Price: None; Package: None; Availability: Unavailable; MP: CH340C; Value: *
U29 = USB-B TH
X1 = X2